# Altium schematic sheet I2C_GPIOEXPANDER_PCF8574.SchDoc
size A3; SheetNumber: 9; SheetTotal: 9
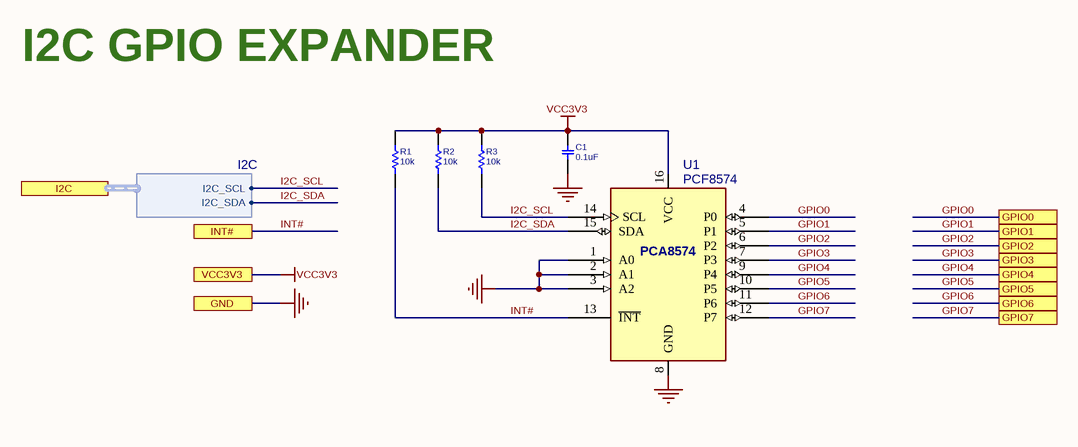
[diagram p0: I2C_GPIOEXPANDER_PCF8574.SchDoc]

## Parts
C1  0.1uF  [C0603]
R1  10k  [R0603]
R2  10k  [R0603]
R3  10k  [R0603]
U1  PCF8574  [SO_16_W]

## Ports
GND, GPIO0, GPIO1, GPIO2, GPIO3, GPIO4, GPIO5, GPIO6, GPIO7, I2C (harness I2C), INT#, VCC3V3

## Harnesses
I2C: I2C_SCL, I2C_SDA

## Nets
GND: C1.1 U1.1(A0) U1.2(A1) U1.3(A2) U1.8(GND) ; port GND
VCC3V3: C1.2 R1.2 R2.2 R3.2 U1.16(VCC) ; port VCC3V3
GPIO0: U1.4(P0) ; port GPIO0
GPIO1: U1.5(P1) ; port GPIO1
GPIO2: U1.6(P2) ; port GPIO2
GPIO3: U1.7(P3) ; port GPIO3
GPIO4: U1.9(P4) ; port GPIO4
GPIO5: U1.10(P5) ; port GPIO5
GPIO6: U1.11(P6) ; port GPIO6
GPIO7: U1.12(P7) ; port GPIO7
I2C_SCL: R3.1 U1.14(SCL) ; port I2C.I2C_SCL
I2C_SDA: R2.1 U1.15(SDA) ; port I2C.I2C_SDA
INT#: R1.1 U1.13(~{INT}) ; port INT#

## Notes on the sheet
- I2C GPIO EXPANDER
- (in symbol PCF8574_SOP16W) PCA8574

## Library data of the parts
C1 = CAP_SMD_MLCC_0805: CAP, MLCC, -F, -V, MATERIAL, -%, 0201; PARAM: -, -%; MANF_P#: MANF_PART#; PRICE: 100= 1$; MANF: -; PARAM2: -V; ASSEMBLY: ASSEMBLY; VALUE: 0.1uF
R1-R3 = RES_SMD_0603: RESISTOR, SMD; PARAM: -W; DESC: DESCRIPTION; DIST#: MOUSER; PARAM2: 1%; MANF_P#: -; MANF: -; ASSEMBLY: ASSEMBLY; PRICE: 100= 0.5$
U1 = PCF8574_SOP16W: IC, I2C IO Expander, 8CH, 100KHz; MANF: Texas Instruments; MANF_P#: PCF8574DW; PARAM2: 2.5~6.0VCC; PARAM: 8CH, 100KHz, -40~85oC; VALUE: PCF8574